# EAGLE design tetrode (EAGLE 9.3.0)
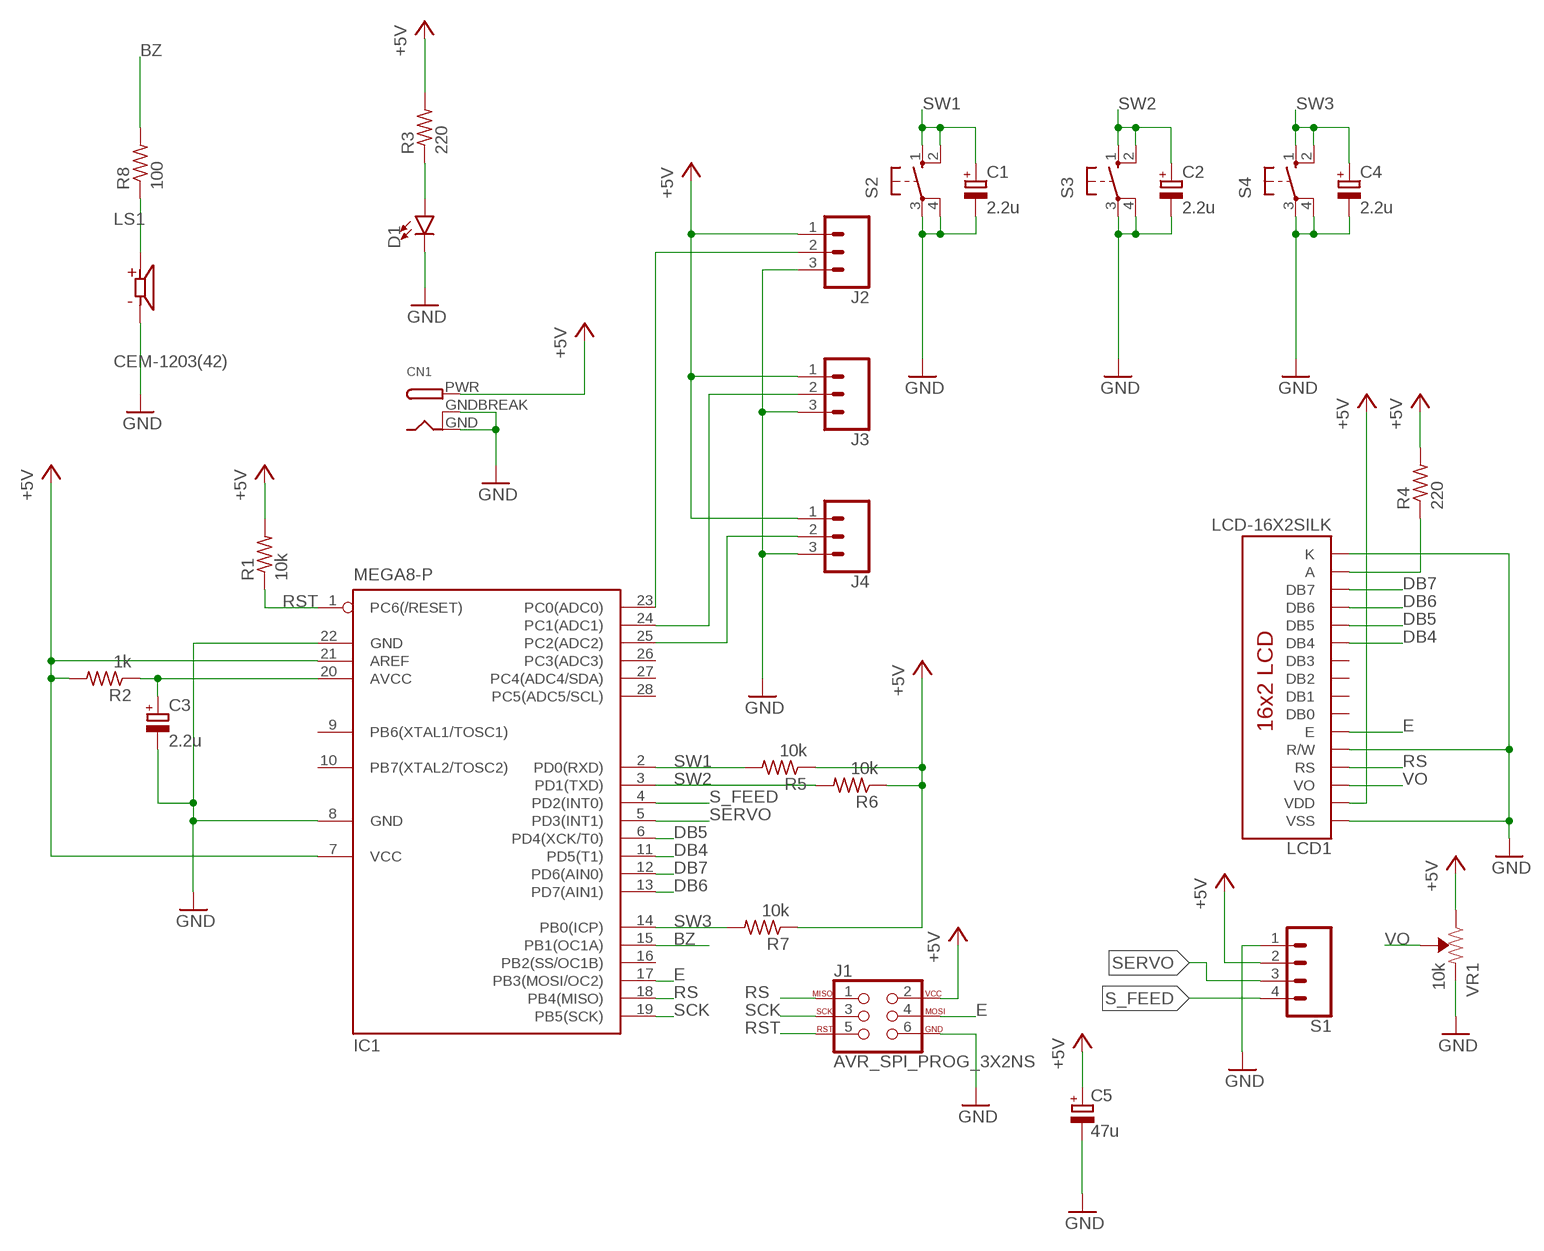
[diagram p0: schematic, sheet 1]

## Parts
C1  2.2u  CPOL-EUE2-5  [E2-5]
C2  2.2u  CPOL-EUE2-5  [E2-5]
C3  2.2u  CPOL-EUE2-5  [E2-5]
C4  2.2u  CPOL-EUE2-5  [E2-5]
C5  47u  CPOL-EUE2.5-6  [E2,5-6]
CN1  DCBARRELPTH  [DCJACK_2MM_PTH]
D1  LED-3MM-NO_SILK  [LED_3MM-NS]
IC1  MEGA8-P  [DIL28-3]
J1  AVR_SPI_PROG_3X2NS  [2X3-NS]
J2  CONN_03  [1X03]
J3  CONN_03  [1X03]
J4  CONN_03  [1X03]
LCD1  LCD-16X2SILK  [LCD-16X2]
LS1  CEM-1203(42)  [CUI_CEM-1203(42)]
R1  10k  R-US_0309/10  [0309/10]
R2  1k  R-US_0309/10  [0309/10]
R3  220  R-US_0309/10  [0309/10]
R4  220  R-US_0309/10  [0309/10]
R5  10k  R-US_0309/10  [0309/10]
R6  10k  R-US_0309/10  [0309/10]
R7  10k  R-US_0309/10  [0309/10]
R8  100  R-US_0309/10  [0309/10]
S1  CONN_04  [1X04]
S2  40-XX  [B3F-40XX]
S3  40-XX  [B3F-40XX]
S4  40-XX  [B3F-40XX]
VR1  10k  TRIMPOT-PTH-10MM-KNOB-1/2W-10%  [TRIMPOT-PTH-3386U]

## Nets
+5V: C5.+ CN1.PWR IC1.7(VCC) IC1.21(AREF) J1.2 J2.1 J3.1 J4.1 LCD1.2(VDD) R1.2 R2.2 R3.2 R4.2 R5.1 R6.1 R7.1 S1.2 VR1.3(CW)
BZ: IC1.15(PB1(OC1A)) R8.2
DB4: IC1.11(PD5(T1)) LCD1.11(DB4)
DB5: IC1.6(PD4(XCK/T0)) LCD1.12(DB5)
DB6: IC1.13(PD7(AIN1)) LCD1.13(DB6)
DB7: IC1.12(PD6(AIN0)) LCD1.14(DB7)
E: IC1.17(PB3(MOSI/OC2)) J1.4 LCD1.6(E)
GND: C1.- C2.- C3.- C4.- C5.- CN1.GND CN1.GNDBREAK D1.K(C) IC1.8(GND) IC1.22(GND) J1.6 J2.3 J3.3 J4.3 LCD1.1(VSS) LCD1.5(R/W) LCD1.16(K) LS1.N S1.1 S2.3(P) S2.4(P1) S3.3(P) S3.4(P1) S4.3(P) S4.4(P1) VR1.1(CCW)
N$1: IC1.23(PC0(ADC0)) J2.2
N$2: D1.A R3.1
N$3: IC1.24(PC1(ADC1)) J3.2
N$5: IC1.25(PC2(ADC2)) J4.2
N$7: C3.+ IC1.20(AVCC) R2.1
N$9: LS1.P R8.1
N$13: LCD1.15(A) R4.1
RS: IC1.18(PB4(MISO)) J1.1 LCD1.4(RS)
RST: IC1.1(PC6(/RESET)) J1.5 R1.1
S_FEED: IC1.4(PD2(INT0)) S1.4
SCK: IC1.19(PB5(SCK)) J1.3
SERVO: IC1.5(PD3(INT1)) S1.3
SW1: C1.+ IC1.2(PD0(RXD)) R5.2 S2.1(S) S2.2(S1)
SW2: C2.+ IC1.3(PD1(TXD)) R6.2 S3.1(S) S3.2(S1)
SW3: C4.+ IC1.14(PB0(ICP)) R7.2 S4.1(S) S4.2(S1)
VO: LCD1.3(VO) VR1.2(WIPER)
Unconnected: IC1.9(PB6(XTAL1/TOSC1)) IC1.10(PB7(XTAL2/TOSC2)) IC1.16(PB2(SS/OC1B)) IC1.26(PC3(ADC3)) IC1.27(PC4(ADC4/SDA)) IC1.28(PC5(ADC5/SCL)) LCD1.7(DB0) LCD1.8(DB1) LCD1.9(DB2) LCD1.10(DB3)

## Library data of the parts
C1-C5 = resistor:CPOL-EU: POLARIZED CAPACITOR, European symbol
CN1 = adafruit:DCBARREL: 2.0mm DC Barrel Jack DCJACK_2MM_PTH - Through Hole Jack (4UConnector: 05537)
D1 = SparkFun-LED:LED: LED (Generic) Standard schematic elements and footprints for 5mm, 3mm, 1206, and 0603 sized LEDs. Generic LEDs with no color specified.
IC1 = atmel:MEGA8-P: MICROCONTROLLER 8 Kbytes FLASH, 1 kbytes SRAM, 512 bytes EEPROM, USART, 4-channel 10 bit ADC, 2-channel 8 bit ADC Pin compatible with Atmega48, ATMega88, ATMega168 Source: avr.lbr; OC_FARNELL: unknown; OC_NEWARK: unknown
J1 = SparkFun-Connectors:AVR_SPI_PROG_3X2: AVR ISP 6 Pin This is the reduced ISP connector for AVR programming. Common on Arduino. This footprint will take up less PCB space and can be used with a 10-pin to 6-pin adapter such as SKU: BOB-08508 **Special note about "TEST_POINT" package. The stop mask is on the top side, so if you want your programming test points to be on the bottom of your board, make sure to place this package on the bottom side of the board. This also ensure that the orientation to program from the bottom side will be correct. SparkFun Products: SparkFun ISP Pogo Adapter <https://www.sparkfun.com/products/11591> - NS Tiny AVR Programmer <https://www.sparkfun.com/products/11801> -PTH
J2-J4 = SparkFun-Connectors:CONN_03: Multi connection point. Often used as Generic Header-pin footprint for 0.1 inch spaced/style header connections On any of the 0.1 inch spaced packages, you can populate with these: Break Away Headers - Straight <https://www.sparkfun.com/products/116> (PRT-00116) Break Away Male Headers - Right Angle <https://www.sparkfun.com/products/553> (PRT-00553) Female Headers <https://www.sparkfun.com/products/115> (PRT-00115) Break Away Headers - Machine Pin <https://www.sparkfun.com/products/117> (PRT-00117) Break Away Female Headers - Swiss Machine Pin <https://www.sparkfun.com/products/743> (PRT-00743) Stackable Header - 3 Pin (Female, 0.1") <https://www.sparkfun.com/products/13875> (PRT-13875) For SCREWTERMINALS and SPRING TERMINALS visit here: Screw Terimnals on SparkFun.com <https://www.sparkfun.com/search/results?term=Screw+Terminals> (5mm/3.5mm/2.54mm spacing) This device is also useful as a general connection point to wire up your design to another part of your project. Our various solder wires solder well into these plated through hole pads. Hook-Up Wire - Assortment (Stranded, 22 AWG) <https://www.sparkfun.com/products/11375> (PRT-11375) Hook-Up Wire - Assortment (Solid Core, 22 AWG) <https://www.sparkfun.com/products/11367> (PRT-11367) View the entire wire category on our website here <https://www.sparkfun.com/categories/141> Special notes: Molex polarized connector foot print use with SKU : PRT-08232 with associated crimp pins and housings.
LCD1 = SparkFun-Displays:LCD-16X2: Standard text-only 16x2 parallel input LCD Basic 16 character by 2 line display. Typically utilizes the extremely common HD44780 parallel interface chipset SparkFun Products: Basic 16x2 Green <https://www.sparkfun.com/products/255> Basic 8x2 Green <https://www.sparkfun.com/products/11122>; SF_ID: LCD-00255
LS1 = CEM-1203_42_:CEM-1203(42): 12 mm, 3.5 V, 85 dB, Through Hole, Magnetic Audio Transducer Buzzer; AVAILABILITY: Unavailable; CUI_PURCHASE_URL: https://www.cuidevices.com/product/audio/buzzers/audio-transducers/cem-1203(42)?utm_source=snapeda.com&utm_medium=referral&utm_campaign=snapedaBOM; DESCRIPTION: 12 mm, 3.5 V, 85 dB, Through Hole, Magnetic Audio Transducer Buzzer; DIGIKEY-PURCHASE-URL: https://snapeda.com/shop?store=DigiKey&id=1320038; MF: CUI Devices; MP: CEM-1203(42); PACKAGE: TO-220 CUI Inc.; PRICE: None
R1-R8 = resistor:R-US_: RESISTOR, American symbol
S1 = SparkFun-Connectors:CONN_04: Multi connection point. Often used as Generic Header-pin footprint for 0.1 inch spaced/style header connections On any of the 0.1 inch spaced packages, you can populate with these: Break Away Headers - Straight <https://www.sparkfun.com/products/116> (PRT-00116) Break Away Male Headers - Right Angle <https://www.sparkfun.com/products/553> (PRT-00553) Female Headers <https://www.sparkfun.com/products/115> (PRT-00115) Break Away Headers - Machine Pin <https://www.sparkfun.com/products/117> (PRT-00117) Break Away Female Headers - Swiss Machine Pin <https://www.sparkfun.com/products/743> (PRT-00743) For SCREWTERMINALS and SPRING TERMINALS visit here: Screw Terimnals on SparkFun.com <https://www.sparkfun.com/search/results?term=Screw+Terminals> (5mm/3.5mm/2.54mm spacing) This device is also useful as a general connection point to wire up your design to another part of your project. Our various solder wires solder well into these plated through hole pads. Hook-Up Wire - Assortment (Stranded, 22 AWG) <https://www.sparkfun.com/products/11375> (PRT-11375) Hook-Up Wire - Assortment (Solid Core, 22 AWG) <https://www.sparkfun.com/products/11367> (PRT-11367) View the entire wire category on our website here <https://www.sparkfun.com/categories/141> Special notes: Molex polarized connector foot print use with SKU : PRT-08231 with associated crimp pins and housings. 1MM SMD Version SKU: PRT-10208; PROD_ID: CONN-09696
S2-S4 = switch-omron:40-XX: OMRON SWITCH; MF: OMRON COMPONENTS USA; MPN: B3F-4000; OC_FARNELL: 176434; OC_NEWARK: 36K3105
VR1 = SparkFun-Resistors:TRIMPOT: Trimming Potentiometer (Trimpot) Three-terminal potentiometers, with an adjustable wiper and two adjustable resistors. A pot can be used to create a configurable voltage divider, or as a variable resistor. "Trimpots" are a subset of potentiometers, usually intended for "set-and-forget" applications. They're often more delicate than standard potentiometers - rated for fewer turns. Variants PTH-KNOB - PTH Trimpot w/ finger-adjustable knob Trimpot 10K with Knob <https://www.sparkfun.com/products/9806> (COM-09806) Datasheet <http://www.sparkfun.com/datasheets/Components/General/TSR-3386.pdf> SMD-3MM-CLOSED-FRAME - SMD 3mm Square Closed-Frame Trimpot Used on e.g. EasyDriver - Stepper Motor Driver <https://www.sparkfun.com/products/12779> Datasheet <http://www.bitechnologies.com/pdfs/22.pdf> (22AR10KTR) SMD-5MM - SMD 5mm Square Closed-Frame Trimpot Used on e.g. IOIO-OTG - V2.2 <https://www.sparkfun.com/products/13613> Datasheet <http://www.vishay.com/docs/51008/ts53.pdf> (TS53YL502MR10) SMD-3MM-1/10W-25% - 3mm Square Open-Frame Trimpot Used on e.g. SparkFun Shapeoko <https://www.sparkfun.com/products/13899> Datasheet <http://www.bourns.com/docs/Product-Datasheets/TC33.pdf> (TC33X-2-103E); PROD_ID: RES-09730; SF_SKU: COM-09806

## Board
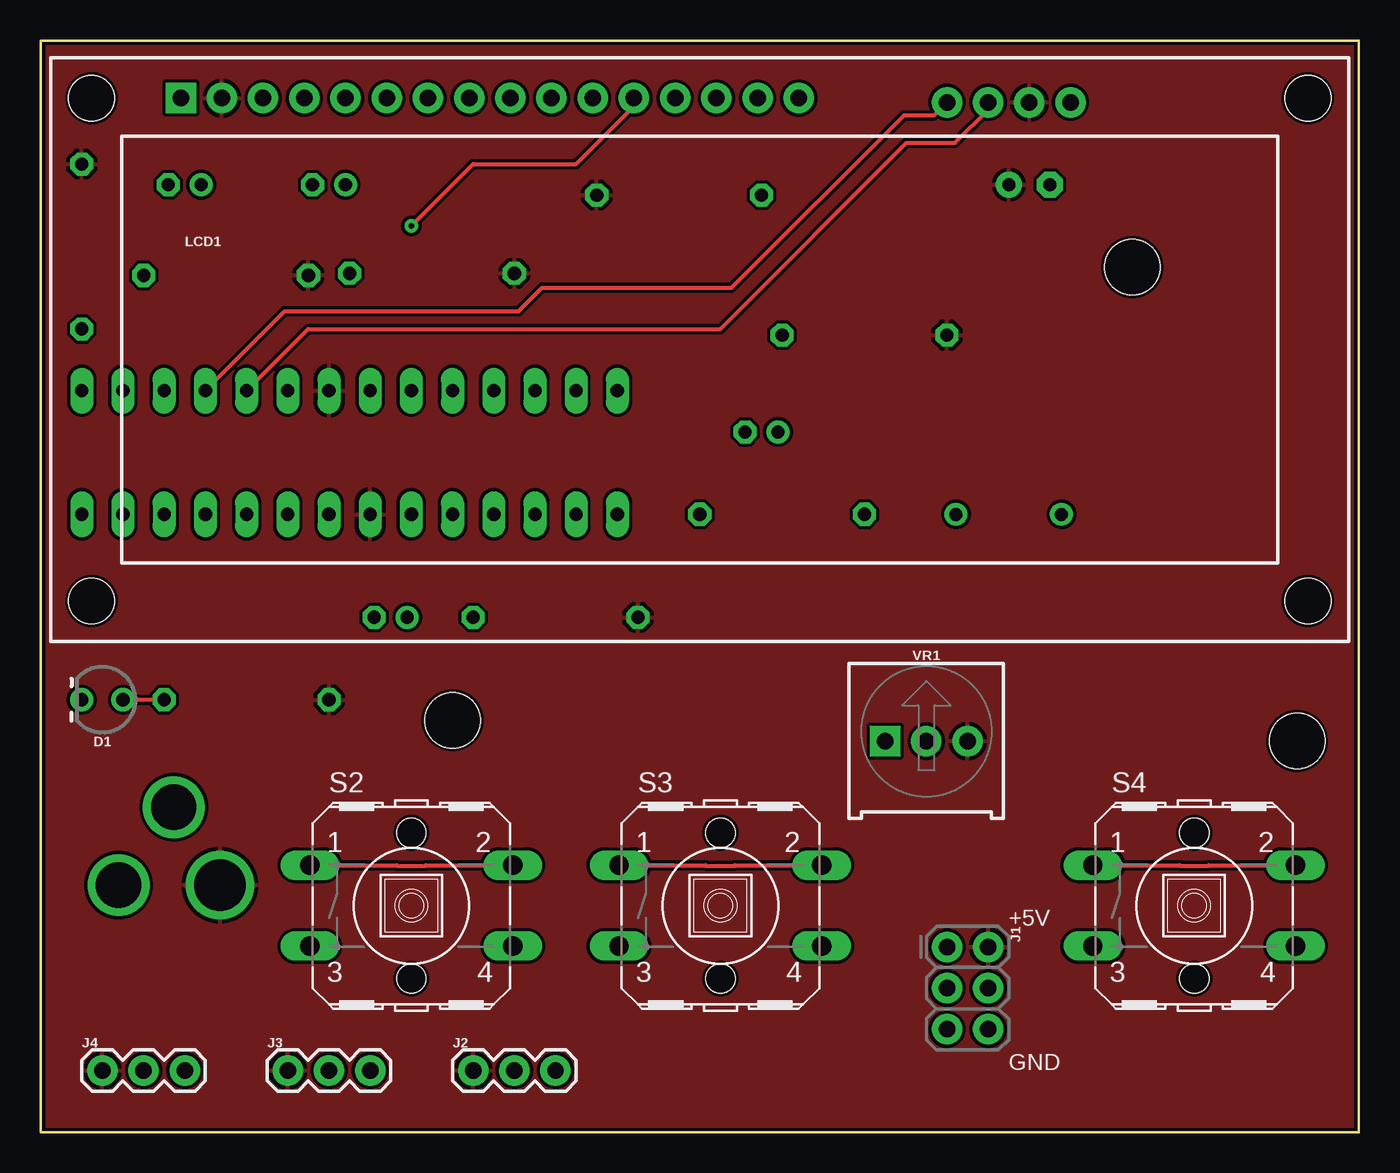
[diagram p1: board, top side]
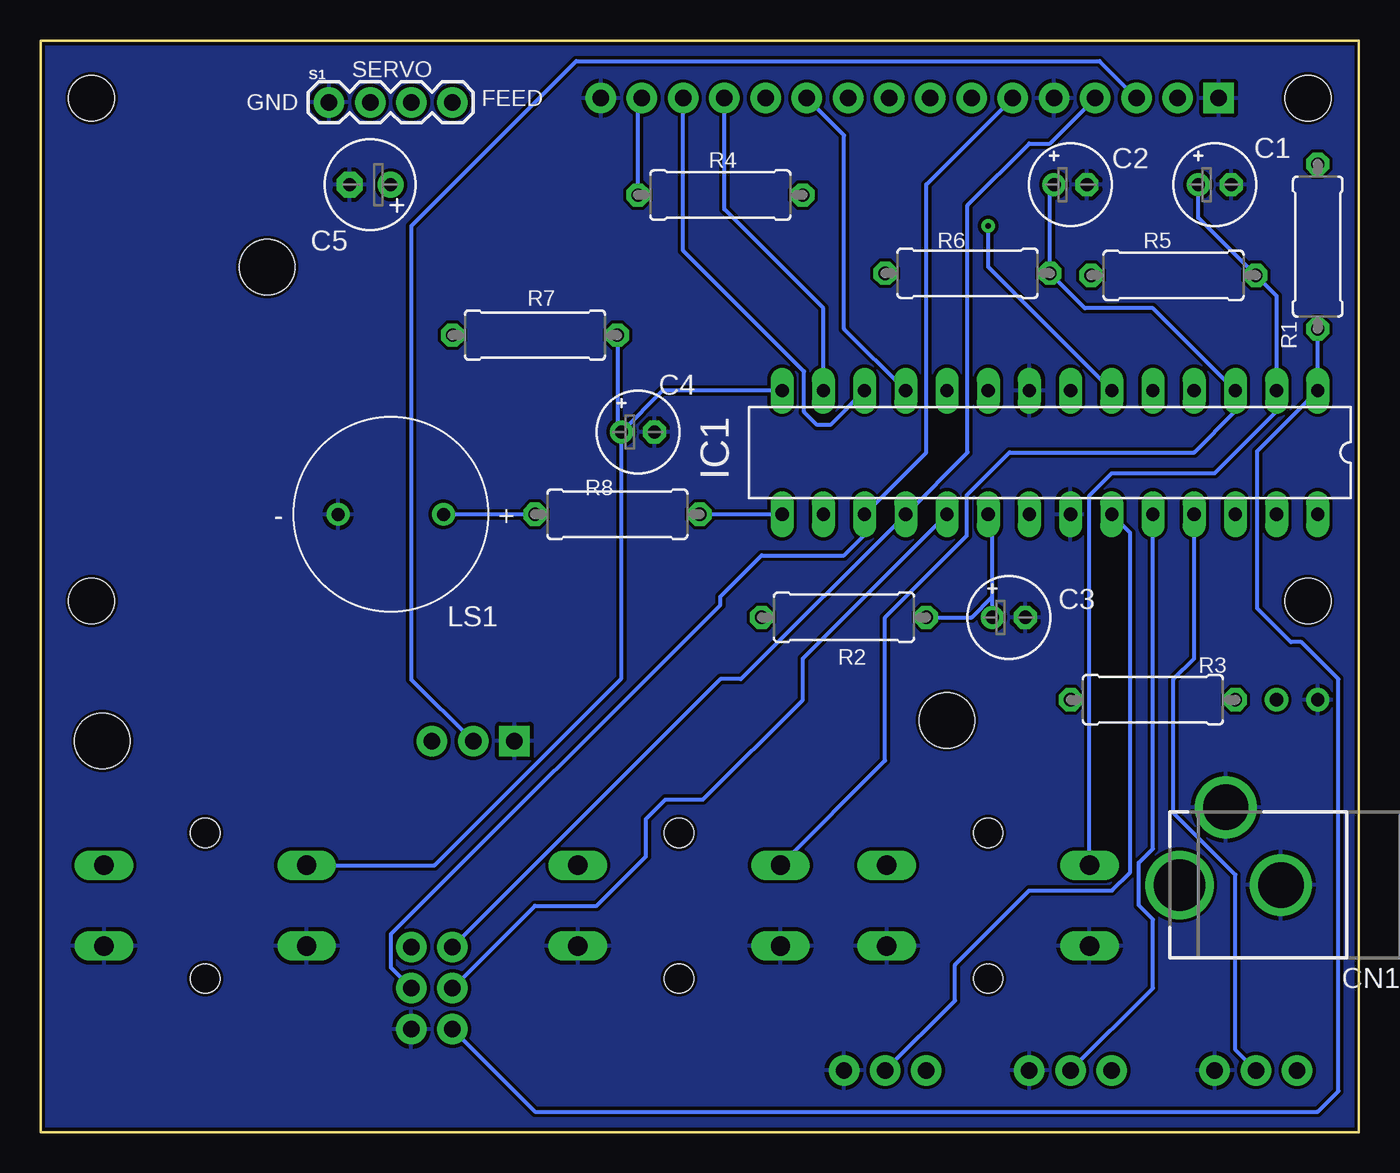
[diagram p2: board, bottom side, seen from below]

Size 81.28 x 67.31 mm. Coordinates in mm from the lower left corner, seen from the top.
Outline: 0,0 81.28,0 81.28,67.31 0,67.31 0,0
Copper layers (1*16): Top 0.035mm / dielectric 1.5mm / Bottom 0.035mm
Design rules "SparkFun": minimum track width 8mil, minimum drill 20mil, track to track 8mil, track to pad 8mil, pad to pad 8mil, via to via 8mil, smd to smd 8mil, copper to edge 8mil, drill to drill 8mil, minimum pad ring 12mil, minimum via ring 10mil, stop-mask expansion 4mil, vias tented up to drill 20mil, thermal gap 10mil
Holes 3.4 mm at 77.47,24.13 67.31,53.34 25.4,25.4

### Footprints (pad centres in the part's own frame; a part is rotated, then mirrored left to right if it is on the bottom)
E2-5 = drill 0.813 pad 1.27: + -1.016,0 | drill 0.813 pad 1.27 octagon: - 1.016,0
E2,5-6 = drill 0.813 pad 1.6: + -1.27,0 | drill 0.813 pad 1.6 octagon: - 1.27,0
DCJACK_2MM_PTH = drill 2.8: GND 0,7.35; GNDBREAK 4.8,10.75 | drill 3.2: PWR 0,13.6
LED_3MM-NS = drill 0.813: A -1.27,0; K 1.27,0
DIL28-3 = drill 0.813 long: 1 -16.51,-3.81; 2 -13.97,-3.81; 3 -11.43,-3.81; 4 -8.89,-3.81; 5 -6.35,-3.81; 6 -3.81,-3.81; 7 -1.27,-3.81; 8 1.27,-3.81; 9 3.81,-3.81; 10 6.35,-3.81; 11 8.89,-3.81; 12 11.43,-3.81; 13 13.97,-3.81; 14 16.51,-3.81; 15 16.51,3.81; 16 13.97,3.81; 17 11.43,3.81; 18 8.89,3.81; 19 6.35,3.81; 20 3.81,3.81; 21 1.27,3.81; 22 -1.27,3.81; 23 -3.81,3.81; 24 -6.35,3.81; 25 -8.89,3.81; 26 -11.43,3.81; 27 -13.97,3.81; 28 -16.51,3.81
2X3-NS = drill 1.016 pad 1.88: 1 -2.54,-1.27; 2 -2.54,1.27; 3 0,-1.27; 4 0,1.27; 5 2.54,-1.27; 6 2.54,1.27
1X03 = drill 1.016 pad 1.88: 1 0,0; 2 2.54,0; 3 5.08,0
LCD-16X2 = drill 1.016 pad 1.88 square: 1 -32,15.5 | drill 1.016 pad 1.88: 2 -29.46,15.5; 3 -26.92,15.5; 4 -24.38,15.5; 5 -21.84,15.5; 6 -19.3,15.5; 7 -16.76,15.5; 8 -14.22,15.5; 9 -11.68,15.5; 10 -9.14,15.5; 11 -6.6,15.5; 12 -4.06,15.5; 13 -1.52,15.5; 14 1.02,15.5; 15 3.56,15.5; 16 6.1,15.5 | hole 2.8: -37.5,15.5; -37.5,-15.5; 37.5,15.5; 37.5,-15.5
CUI_CEM-1203(42) = drill 0.8: N 3.25,0; P -3.25,0
0309/10 = drill 0.813 octagon: 1 -5.08,0; 2 5.08,0
1X04 = drill 1.016 pad 1.88: 1 0,0; 2 2.54,0; 3 5.08,0; 4 7.62,0
B3F-40XX = drill 1.194 long: 1 -6.248,2.489; 2 6.248,2.489; 3 -6.248,-2.489; 4 6.248,-2.489 | hole 1.803: 0,-4.496; 0,4.496
TRIMPOT-PTH-3386U = drill 1.016 pad 1.88 square: 1 -2.54,-0.015 | drill 1.016 pad 1.88: 2 0,-0.015; 3 2.54,-0.015

### Placement (x,y rotation side)
C1  8.89,58.42 0 bottom
C2  17.78,58.42 0 bottom
C3  21.59,31.75 0 bottom
C4  44.45,43.18 0 bottom
C5  60.96,58.42 180 bottom
CN1  -2.54,15.24 90 bottom
D1  3.81,26.67 180 top
IC1  19.05,41.91 180 bottom
J1  57.15,8.89 270 top
J2  26.67,3.81 0 top
J3  15.24,3.81 0 top
J4  3.81,3.81 0 top
LCD1  40.64,48.26 0 top
LS1  59.69,38.1 180 bottom
R1  2.54,54.61 90 bottom
R2  31.75,31.75 180 bottom
R3  12.7,26.67 180 bottom
R4  39.37,57.78 0 bottom
R5  11.43,52.83 0 bottom
R6  24.13,52.96 0 bottom
R7  50.8,49.15 0 bottom
R8  45.72,38.1 0 bottom
S1  63.5,63.5 0 bottom
S2  22.86,13.97 0 top
S3  41.91,13.97 0 top
S4  71.12,13.97 0 top
VR1  54.61,24.13 0 top

### Tracks (layer width: path | path; a pad name or v marks a point on that pad's centre or on a via)
+5V
  pour Top: 0,0 0,101.6 107.95,101.6 107.95,0
BZ
  Bottom 0.254: IC1.15 R8.2
DB4
  Bottom 0.254: IC1.11 31.75,49.53 31.75,61.47 LCD1.11
DB5  (via drill 0.35)
  Top 0.254: v22.86,55.88 26.67,59.69 33.02,59.69 36.58,63.25 LCD1.12
  Bottom 0.254: IC1.6 22.86,53.34 v22.86,55.88
DB6
  Bottom 0.254: IC1.13 33.02,50.8 39.12,56.9 LCD1.13
DB7
  Bottom 0.254: LCD1.14 41.66,54.36 34.21,46.91 34.21,44.42 33.41,43.61 32.59,43.61 IC1.12
E
  Bottom 0.254: J1.4 59.69,10.16 59.69,12.19 39.37,32.51 39.37,33.02 36.83,35.56 31.75,35.56 30.48,36.83 IC1.17 26.67,41.91 26.67,58.43 LCD1.6
GND
  pour Bottom: 0,0 0,101.6 107.95,101.6 107.95,0
N$1
  Bottom 0.254: J2.2 24.91,8.12 24.91,10.32 20.32,14.9 15.23,14.9 14.1,16.04 14.1,36.96 IC1.23
N$2
  Top 0.254: R3.1 D1.A
N$3
  Bottom 0.254: J3.2 12.7,8.89 12.7,13.12 13.57,14 13.57,16.61 12.7,17.48 IC1.24
N$5
  Bottom 0.254: J4.2 7.62,5.08 7.62,15.88 11.43,19.68 11.43,27.94 10.16,29.21 IC1.25
N$7
  Bottom 0.254: C3.+ 22.61,33.02 | 22.61,33.02 22.61,37.85 IC1.20 | 22.61,33.02 23.88,31.75 R2.1
N$9
  Bottom 0.254: R8.1 LS1.P
N$13
  Bottom 0.254: R4.1 44.45,63.51 LCD1.15
RS
  Bottom 0.254: J1.1 39.37,27.94 38.1,27.94 IC1.18 24.13,41.91 24.13,57.15 20.32,60.96 19.05,60.96 LCD1.4
RST
  Bottom 0.254: R1.1 IC1.1 6.27,41.99 6.27,32.3 4.19,30.22 3.55,30.22 1.27,27.94 1.27,2.54 2.54,1.27 50.8,1.27 J1.5
S_FEED
  Top 0.254: IC1.4 15.06,50.62 29.47,50.62 30.92,52.07 42.6,52.07 53.22,62.69 55.07,62.69 S1.4
SCK
  Bottom 0.254: J1.3 50.8,13.97 46.99,13.97 43.95,17 43.95,19.31 42.76,20.51 40.45,20.51 34.29,26.67 34.29,29.21 IC1.19
SERVO
  Top 0.254: S1.3 58.42,63.05 56.38,61.01 53.39,61.01 41.91,49.53 16.51,49.53 IC1.5
SW1
  Top 0.254: S2.1 21.98,16.46 22.01,16.42 23.71,16.42 23.75,16.46 S2.2
  Bottom 0.254: C1.+ 9.91,56.39 R5.2 5.08,51.56 IC1.2 5.08,44.45 8.89,40.64 15.24,40.64 16.61,39.27 S2.1
SW2
  Top 0.254: S3.1 41.02,16.46 41.06,16.42 42.76,16.42 42.8,16.46 S3.2
  Bottom 0.254: C2.+ 19.05,58.17 R6.2 16.89,50.8 12.7,50.8 IC1.3 7.62,44.45 10.16,41.91 21.55,41.91 24.18,39.28 24.18,36.78 29.21,31.75 29.21,22.91 S3.1
SW3
  Top 0.254: S4.1 70.23,16.46 70.27,16.42 71.97,16.42 72,16.46 S4.2
  Bottom 0.254: IC1.14 42.93,45.72 C4.+ | R7.2 45.72,43.43 C4.+ | C4.+ 45.47,27.99 57,16.46 S4.1
VO
  Bottom 0.254: VR1.2 58.42,27.93 58.42,55.88 48.26,66.04 16,66.04 LCD1.3

### Text on the board
tPlace: +5V | GND
bPlace: SERVO | FEED | GND